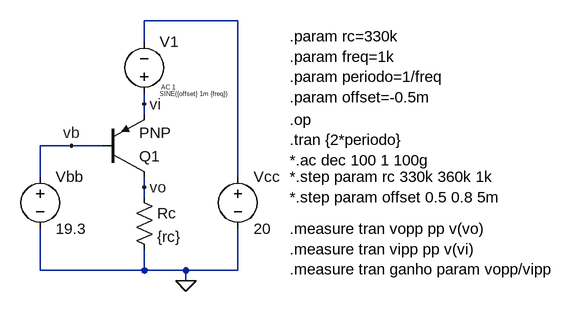
[diagram p0: schematic common_base_pnp_ex1.asc]
common_base_pnp_ex1.asc, the LTspice schematic file:
Version 4
SHEET 1 960 680
WIRE 352 -48 208 -48
WIRE 208 -16 208 -48
WIRE 208 80 208 64
WIRE 208 96 208 80
WIRE 96 144 48 144
WIRE 144 144 96 144
WIRE 48 192 48 144
WIRE 352 192 352 -48
WIRE 208 208 208 192
WIRE 208 224 208 208
WIRE 48 336 48 272
WIRE 208 336 208 304
WIRE 208 336 48 336
WIRE 272 336 208 336
WIRE 352 336 352 272
WIRE 352 336 272 336
WIRE 272 352 272 336
FLAG 272 352 0
FLAG 208 208 vo
FLAG 208 80 vi
FLAG 96 144 vb
SYMBOL res 192 208 R0
SYMATTR InstName Rc
SYMATTR Value {rc}
SYMBOL voltage 352 176 R0
WINDOW 123 0 0 Left 0
WINDOW 39 0 0 Left 0
SYMATTR InstName Vcc
SYMATTR Value 20
SYMBOL voltage 48 176 R0
WINDOW 123 0 0 Left 0
WINDOW 39 0 0 Left 0
SYMATTR InstName Vbb
SYMATTR Value 19.3
SYMBOL pnp 144 192 M180
SYMATTR InstName Q1
SYMBOL voltage 208 80 M180
WINDOW 0 24 96 Left 2
WINDOW 3 24 16 Left 0
WINDOW 123 26 26 Left 0
WINDOW 39 0 0 Left 0
SYMATTR InstName V1
SYMATTR Value SINE({offset} 1m {freq})
SYMATTR Value2 AC 1
TEXT 432 -24 Left 2 !.param rc=330k\n.param freq=1k\n.param periodo=1/freq\n.param offset=-0.5m
TEXT 432 104 Left 2 !.op\n.tran {2*periodo}\n*.ac dec 100 1 100g
TEXT 432 272 Left 2 !.measure tran vopp pp v(vo)\n.measure tran vipp pp v(vi)\n.measure tran ganho param vopp/vipp
TEXT 432 192 Left 2 !*.step param rc 330k 360k 1k\n*.step param offset 0.5 0.8 5m

The netlist it stands for:
* common_base_pnp_ex1.asc
Rc vo 0 {rc}
Vcc N001 0 20
Vbb vb 0 19.3
Q1 vo vb vi 0 PNP
V1 vi N001 SINE({offset} 1m {freq}) AC 1
.model NPN NPN
.model PNP PNP
.lib standard.bjt
.param rc=330k
.param freq=1k
.param periodo=1/freq
.param offset=-0.5m
.op
.tran {2*periodo}
*.ac dec 100 1 100g
.measure tran vopp pp v(vo)
.measure tran vipp pp v(vi)
.measure tran ganho param vopp/vipp
*.step param rc 330k 360k 1k
*.step param offset 0.5 0.8 5m
.backanno
.end